# Altium schematic sheet Power.SchDoc
size A; SheetNumber: 2; SheetTotal: 5
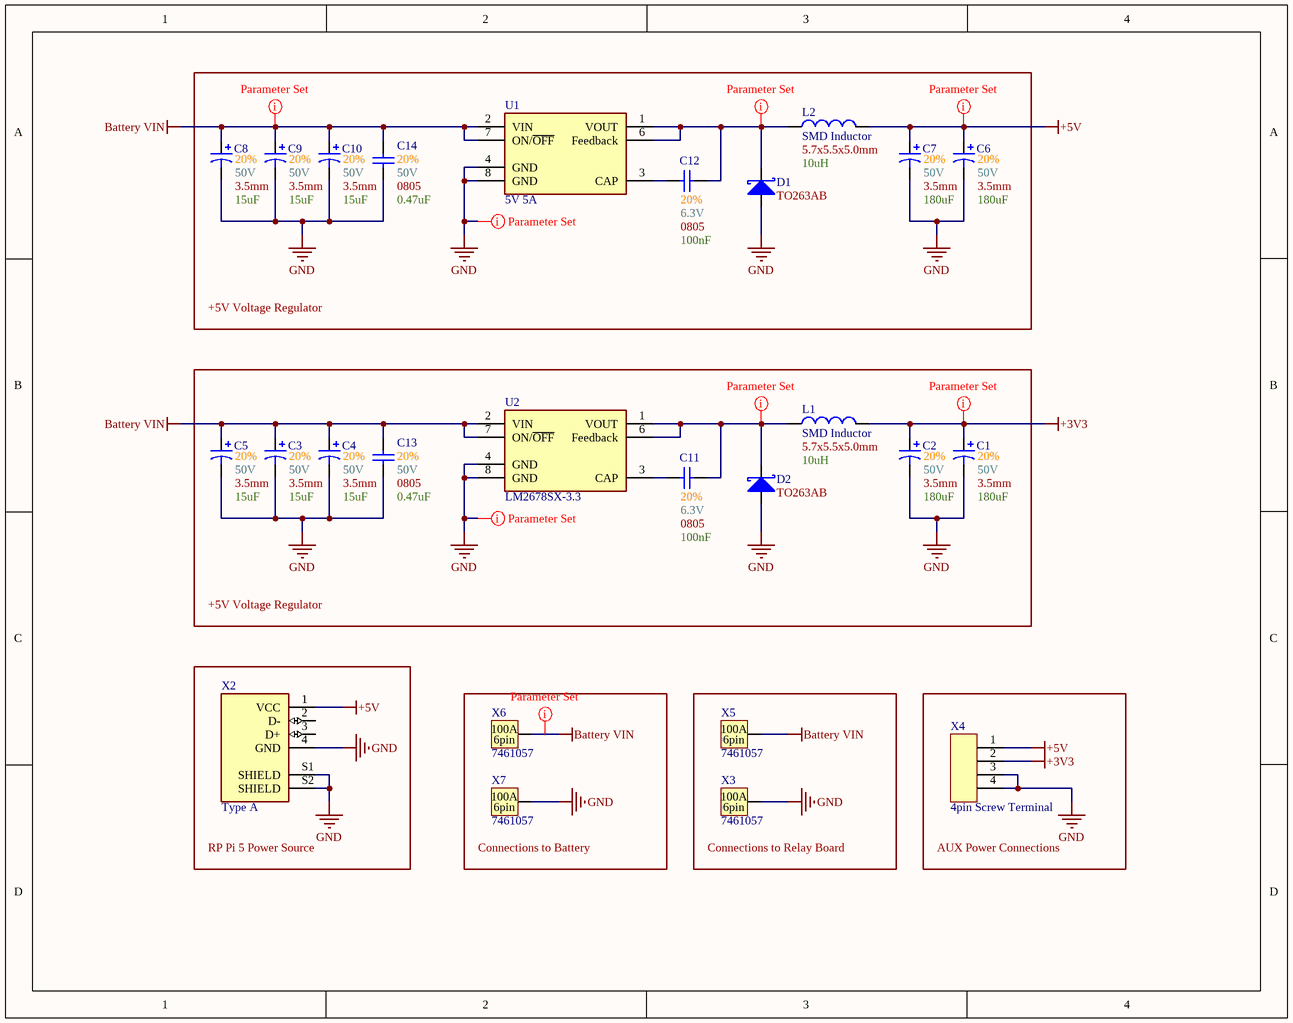
[diagram p0: Power.SchDoc]

## Parts
C1  Tolerance: 20%  Voltage: 50V  Pin Spacing: 3.5mm  Capacitance: 180uF  [[Cap] Thru-Hole Polarized 3.5mm]  (hidden comment: Thru-Hole Polarized)
C2  Tolerance: 20%  Voltage: 50V  Pin Spacing: 3.5mm  Capacitance: 180uF  [[Cap] Thru-Hole Polarized 3.5mm]  (hidden comment: Thru-Hole Polarized)
C3  Tolerance: 20%  Voltage: 50V  Pin Spacing: 3.5mm  Capacitance: 15uF  [[Cap] Thru-Hole Polarized 3.5mm]  (hidden comment: Thru-Hole Polarized)
C4  Tolerance: 20%  Voltage: 50V  Pin Spacing: 3.5mm  Capacitance: 15uF  [[Cap] Thru-Hole Polarized 3.5mm]  (hidden comment: Thru-Hole Polarized)
C5  Tolerance: 20%  Voltage: 50V  Pin Spacing: 3.5mm  Capacitance: 15uF  [[Cap] Thru-Hole Polarized 3.5mm]  (hidden comment: Thru-Hole Polarized)
C6  Tolerance: 20%  Voltage: 50V  Pin Spacing: 3.5mm  Capacitance: 180uF  [[Cap] Thru-Hole Polarized 3.5mm]  (hidden comment: Thru-Hole Polarized)
C7  Tolerance: 20%  Voltage: 50V  Pin Spacing: 3.5mm  Capacitance: 180uF  [[Cap] Thru-Hole Polarized 3.5mm]  (hidden comment: Thru-Hole Polarized)
C8  Tolerance: 20%  Voltage: 50V  Pin Spacing: 3.5mm  Capacitance: 15uF  [[Cap] Thru-Hole Polarized 3.5mm]  (hidden comment: Thru-Hole Polarized)
C9  Tolerance: 20%  Voltage: 50V  Pin Spacing: 3.5mm  Capacitance: 15uF  [[Cap] Thru-Hole Polarized 3.5mm]  (hidden comment: Thru-Hole Polarized)
C10  Tolerance: 20%  Voltage: 50V  Pin Spacing: 3.5mm  Capacitance: 15uF  [[Cap] Thru-Hole Polarized 3.5mm]  (hidden comment: Thru-Hole Polarized)
C11  Tolerance: 20%  Size Package: 0805  Capacitance: 100nF  Voltage: 6.3V  [[Cap] SMD 0805]  (hidden comment: SMD Nonpolarized)
C12  Tolerance: 20%  Size Package: 0805  Capacitance: 100nF  Voltage: 6.3V  [[Cap] SMD 0805]  (hidden comment: SMD Nonpolarized)
C13  Tolerance: 20%  Size Package: 0805  Capacitance: 0.47uF  Voltage: 50V  [[Cap] SMD 0805]  (hidden comment: SMD Nonpolarized)
C14  Tolerance: 20%  Size Package: 0805  Capacitance: 0.47uF  Voltage: 50V  [[Cap] SMD 0805]  (hidden comment: SMD Nonpolarized)
D1  Size Package: TO263AB  [[Diode] SMD TO263AB]  (hidden comment: Schottky)
D2  Size Package: TO263AB  [[Diode] SMD TO263AB]  (hidden comment: Schottky)
L1  SMD Inductor  Size Package: 5.7x5.5x5.0mm  Inductance: 10uH  [[Inductor] 5.7 x 5.5 x 5 mm]
L2  SMD Inductor  Size Package: 5.7x5.5x5.0mm  Inductance: 10uH  [[Inductor] 5.7 x 5.5 x 5 mm]
U1  5V 5A  [[Reg] 5V Regulator (3)]
U2  LM2678SX-3.3  [[Reg] 3V3 Regulator (3)]
X2  Type A  [[Port] USB Type-A Female]
X3  7461057  [[Port] Shank Connector (100A)]
X4  4pin Screw Terminal  [[Screw Terminal] 4pin 5mm]
X5  7461057  [[Port] Shank Connector (100A)]
X6  7461057  [[Port] Shank Connector (100A)]
X7  7461057  [[Port] Shank Connector (100A)]

## Blocks framed on the sheet
+5V Voltage Regulator: C6-C10 C12 C14 D1 L2 U1
+5V Voltage Regulator: C1-C5 C11 C13 D2 L1 U2
RP Pi 5 Power Source: X2
Connections to Battery: X6 X7
Connections to Relay Board: X3 X5
AUX Power Connections: X4

## Nets
+3V3: C1.1 C2.1 L1.2 X4.2
+5V: C6.1 C7.1 L2.2 X2.1(VCC) X4.1
Battery VIN: C3.1 C4.1 C5.1 C8.1 C9.1 C10.1 C13.2 C14.2 U1.2(VIN) U1.7(ON/~{OFF}) U2.2(VIN) U2.7(ON/~{OFF}) X5.1 X6.1
GND: C1.2 C2.2 C3.2 C4.2 C5.2 C6.2 C7.2 C8.2 C9.2 C10.2 C13.1 C14.1 D1.2(A) D2.2(A) U1.4(GND) U1.8(GND) U2.4(GND) U2.8(GND) X2.4(GND) X2.S1(SHIELD) X2.S2(SHIELD) X3.1 X4.3 X4.4 X7.1
NetC11_1: C11.1 U2.3(CAP)
NetC11_2: C11.2 D2.1(K) L1.1 U2.1(VOUT) U2.6(Feedback)
NetC12_1: C12.1 U1.3(CAP)
NetC12_2: C12.2 D1.1(K) L2.1 U1.1(VOUT) U1.6(Feedback)

Not connected (* = marked no-connect by the designer): X2 2(D-) 3(D+)

## Layout directives
net class Supply_Nets: +3V3, +5V, Battery VIN, GND, NetC11_2, NetC12_2
net class Motor VOUT: Battery VIN

## Notes on the sheet
- (in symbol [Port] Shank Connector (100A)) 100A; 6pin

## Library data of the parts
C1 C2 C6 C7 = [Cap] Thru-Hole Polarized
C3-C5 C8-C10 = [Cap] Thru-Hole Polarized: EEU-FC1H150H
C11-C14 = [Cap] SMD Nonpolarized
D1 D2 = [Diode] SMD Schottky: Generic
L1 L2 = [Inductor] SMD Inductor: JLC Part #: *; Mouser Part #: *
U1 = [Reg] 5V Regulator (3): LM2678SX-5.0/NOPB; Supplier 1: DigiKey; Supplier Part Number 1: LM2678SX-5.0/NOPBCT-ND
U2 = [Reg] 3V3 Regulator (3): LM2678SX-3.3/NOPB; Supplier 1: DigiKey; Supplier Part Number 1: LM2678SX-3.3/NOPBCT-ND
X2 = [Port] USB Type-A Female (Thru-Hole)
X3 X5-X7 = [Port] Shank Connector (100A): 7461057, internal thread
X4 = [Screw Terminal] 4pin